# EAGLE design ethercat_shield_mkIIb (EAGLE 9.6.2)
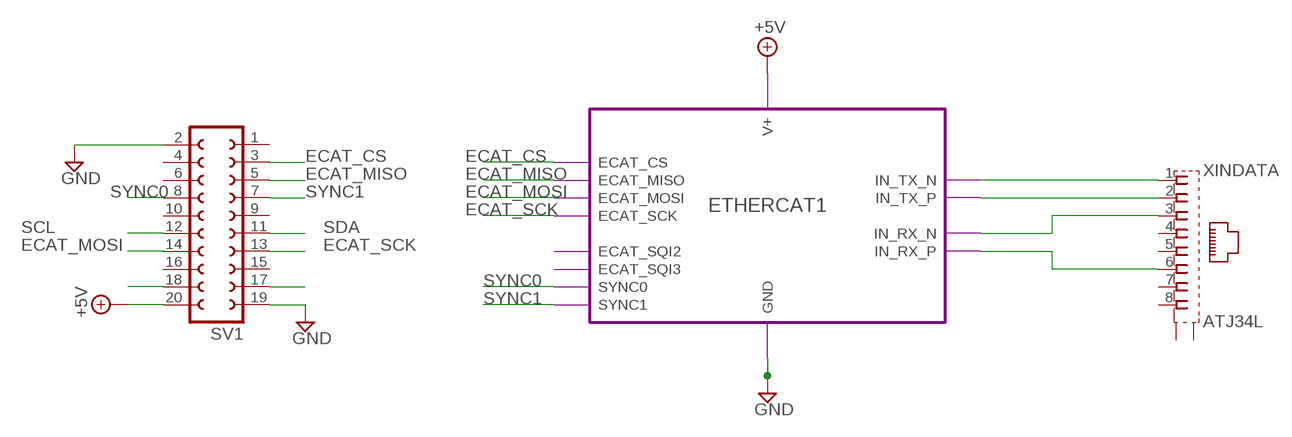
[diagram p0: schematic, sheet 1]

## Parts
SV1  FE10-2W  [FE10-2W]
XIN  ATJ34L  [J1]

## Module instances
ETHERCAT1 = ETHERCAT

## Nets
+5V [power]: SV1.20 ; port ETHERCAT1.V+
ECAT_CS: SV1.3 ; port ETHERCAT1.ECAT_CS
ECAT_MISO: SV1.5 ; port ETHERCAT1.ECAT_MISO
ECAT_MOSI: SV1.14 ; port ETHERCAT1.ECAT_MOSI
ECAT_SCK: SV1.13 ; port ETHERCAT1.ECAT_SCK
GND: SV1.2 SV1.19 ; port ETHERCAT1.GND
N$16: SV1.18
N$19: SV1.17
RA_N: XIN.3 ; port ETHERCAT1.IN_RX_N
RA_P: XIN.6 ; port ETHERCAT1.IN_RX_P
SCL: SV1.12
SDA: SV1.11
SYNC0: SV1.8 ; port ETHERCAT1.SYNC0
SYNC1: SV1.7 ; port ETHERCAT1.SYNC1
TA_N: XIN.1 ; port ETHERCAT1.IN_TX_N
TA_P: XIN.2 ; port ETHERCAT1.IN_TX_P
Unconnected: SV1.1 SV1.4 SV1.6 SV1.9 SV1.10 SV1.15 SV1.16 XIN.4 XIN.5 XIN.7 XIN.8 XIN.9(LY:A) XIN.10(LY:C) XIN.11(LG:A) XIN.12(LG:C) XIN.M1(DATA:S1) XIN.M2(DATA:S2)

## Library data of the parts
SV1 = con-lsta:FE10-2W: FEMALE HEADER; OC_FARNELL: unknown; OC_NEWARK: unknown
XIN = msrm:ATJ34L

## Module ETHERCAT
Ports: ECAT_CS(in) ECAT_MISO(out) ECAT_MOSI(io) ECAT_SCK(in) ECAT_SQI2(io) ECAT_SQI3(io) V+(pwr) GND(pwr) IN_TX_N(out) IN_TX_P(out) IN_RX_N(out) IN_RX_P(out) SYNC0(io) SYNC1(io)
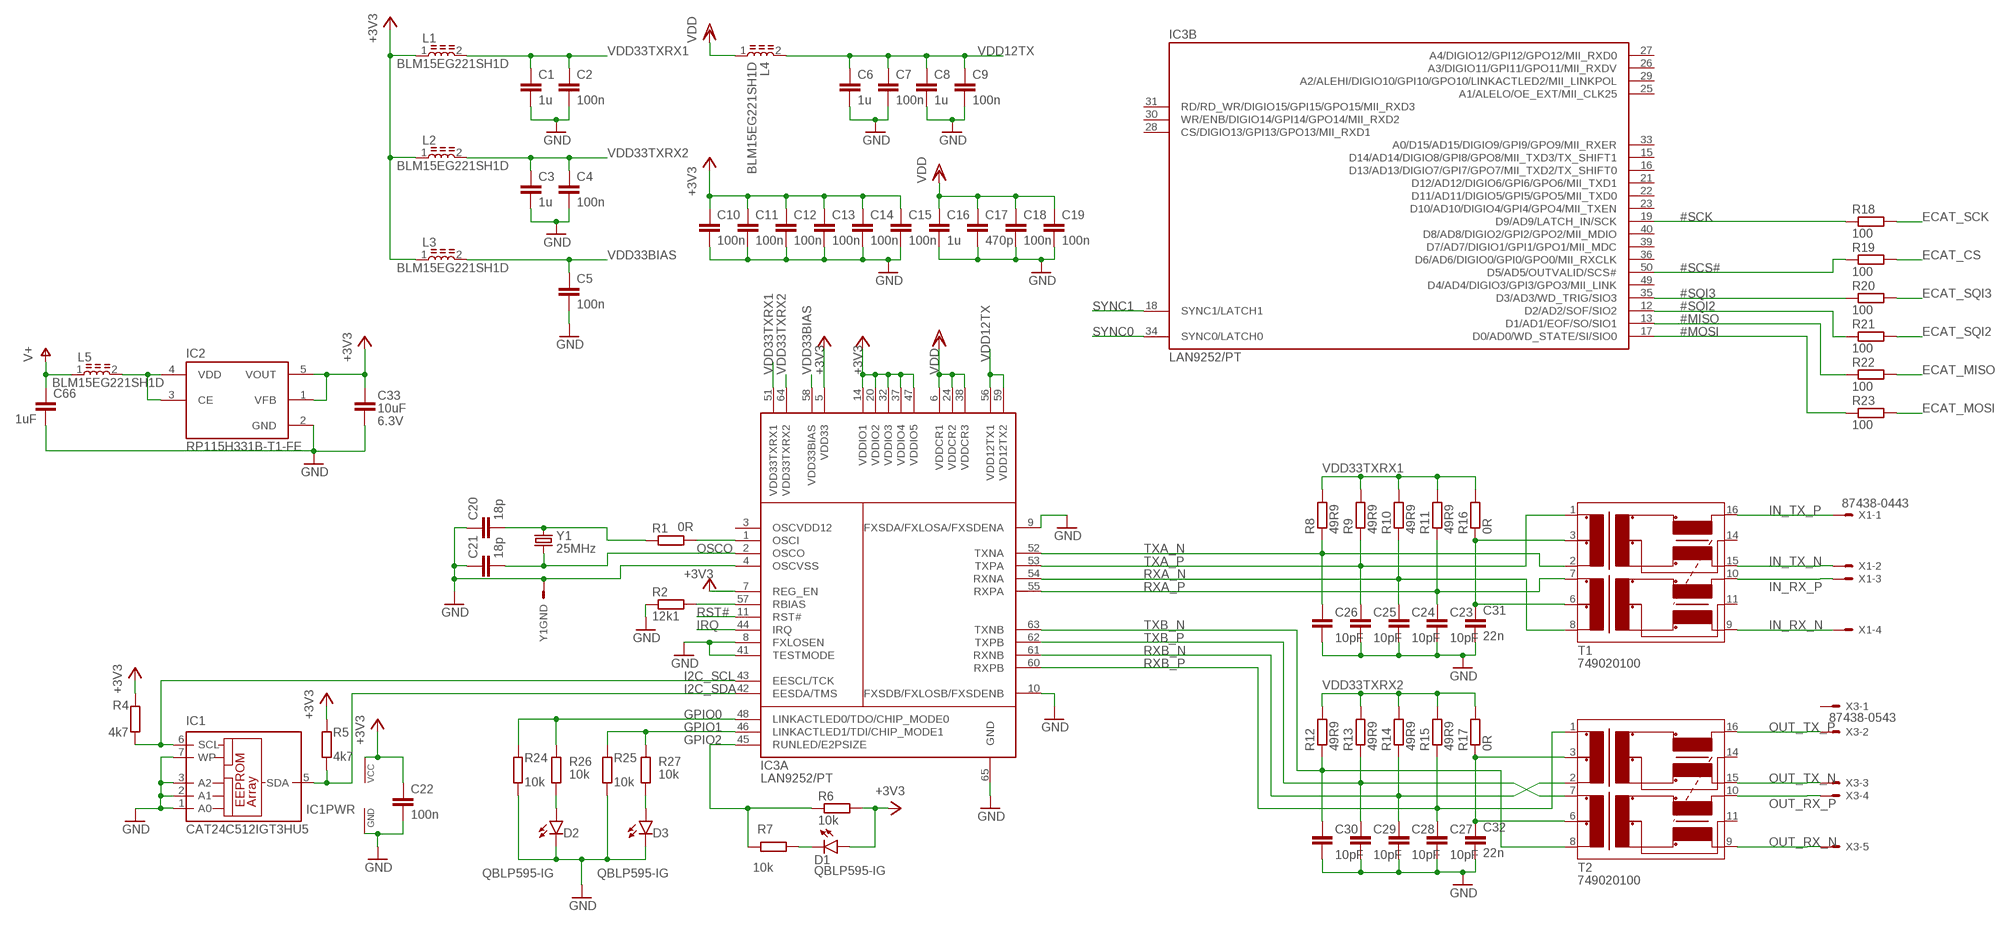
[diagram p1: schematic, module ETHERCAT, sheet 1]

### Parts
C1  1u  GCM155C71A105KE38D  [C0402]
C2  100n  GCM155R71C104JA55  [C0402]
C3  1u  GCM155C71A105KE38D  [C0402]
C4  100n  GCM155R71C104JA55  [C0402]
C5  100n  GCM155R71C104JA55  [C0402]
C6  1u  GCM155C71A105KE38D  [C0402]
C7  100n  GCM155R71C104JA55  [C0402]
C8  1u  GCM155C71A105KE38D  [C0402]
C9  100n  GCM155R71C104JA55  [C0402]
C10  100n  GCM155R71C104JA55  [C0402]
C11  100n  GCM155R71C104JA55  [C0402]
C12  100n  GCM155R71C104JA55  [C0402]
C13  100n  GCM155R71C104JA55  [C0402]
C14  100n  GCM155R71C104JA55  [C0402]
C15  100n  GCM155R71C104JA55  [C0402]
C16  1u  GCM155C71A105KE38D  [C0402]
C17  470p  GCM155R71H471KA37  [C0402]
C18  100n  GCM155R71C104JA55  [C0402]
C19  100n  GCM155R71C104JA55  [C0402]
C20  18p  GCM1555C1H180JA16  [C0402]
C21  18p  GCM1555C1H180JA16  [C0402]
C22  100n  GCM155R71C104JA55  [C0402]
C23  GCM1555C1H100JA16  [C0402]
C24  GCM1555C1H100JA16  [C0402]
C25  GCM1555C1H100JA16  [C0402]
C26  GCM1555C1H100JA16  [C0402]
C27  GCM1555C1H100JA16  [C0402]
C28  GCM1555C1H100JA16  [C0402]
C29  GCM1555C1H100JA16  [C0402]
C30  GCM1555C1H100JA16  [C0402]
C31  22n  GCM155R71E223KA55  [C0402]
C32  22n  GCM155R71E223KA55  [C0402]
C33  GRM155C80J106ME11D  [C0402]
C66  1uF  GCM155C71A105KE38D  [C0402]  (not fitted in variant +3V3)
D1  QBLP595-IG  [LED0402]
D2  QBLP595-IG  [LED0402]
D3  QBLP595-IG  [LED0402]
IC1  CAT24C512IGT3HU5  [UDFN8]
IC2  RP115H331B-T1-FE  [SOT-89-5]
IC3  LAN9252/PT  [TQFP64-T570]
L1  BLM15EG221SH1D  [BEAD0402]
L2  BLM15EG221SH1D  [BEAD0402]
L3  BLM15EG221SH1D  [BEAD0402]
L4  BLM15EG221SH1D  [BEAD0402]
L5  BLM15EG221SH1D  [BEAD0402]
R1  0R  RT0402FRE070RL  [R0402]
R2  12k1  RT0402FRE0712K1L  [R0402]
R4  4k7  RT0402FRE074K7L  [R0402]
R5  4k7  RT0402FRE074K7L  [R0402]
R6  10k  RT0402FRE0710KL  [R0402]
R7  RL0402FR-7W10KL  [R0402]
R8  49R9  RT0402FRE0749R9L  [R0402]
R9  49R9  RT0402FRE0749R9L  [R0402]
R10  49R9  RT0402FRE0749R9L  [R0402]
R11  49R9  RT0402FRE0749R9L  [R0402]
R12  49R9  RT0402FRE0749R9L  [R0402]
R13  49R9  RT0402FRE0749R9L  [R0402]
R14  49R9  RT0402FRE0749R9L  [R0402]
R15  49R9  RT0402FRE0749R9L  [R0402]
R16  0R  RT0402FRE070RL  [R0402]
R17  0R  RT0402FRE070RL  [R0402]
R18  100  RT0402FRE07100RL  [R0402]
R19  100  RT0402FRE07100RL  [R0402]
R20  100  RT0402FRE07100RL  [R0402]
R21  100  RT0402FRE07100RL  [R0402]
R22  100  RT0402FRE07100RL  [R0402]
R23  100  RT0402FRE07100RL  [R0402]
R24  10k  RT0402FRE0710KL  [R0402]
R25  10k  RT0402FRE0710KL  [R0402]
R26  RL0402FR-7W10KL  [R0402]
R27  RL0402FR-7W10KL  [R0402]
T1  749020100  [SOIC127P965X533-16-TRAFO]
T2  749020100  [SOIC127P965X533-16-TRAFO]
X1  87438-0443  [87438-04]
X3  87438-0543  [87438-05]
Y1  ECS-250-18-36B-CKY-TR  [ECX-2236]

### Nets
#MISO: IC3.13(B:D1/AD1/EOF/SO/SIO1) R22.1
#MOSI: IC3.17(B:D0/AD0/WD_STATE/SI/SIO0) R23.1
#SCK: IC3.19(B:D9/AD9/LATCH_IN/SCK) R18.1
#SCS#: IC3.50(B:D5/AD5/OUTVALID/SCS#) R19.1
#SQI2: IC3.12(B:D2/AD2/SOF/SIO2) R21.1
#SQI3: IC3.35(B:D3/AD3/WD_TRIG/SIO3) R20.1
+3V3 [power]: C10.1 C11.1 C12.1 C13.1 C14.1 C15.1 C22.1 C33.1 D1.2(A) IC1.8(VCC) IC2.1(VFB) IC2.5(VOUT) IC3.5(A:VDD33) IC3.7(A:REG_EN) IC3.14(A:VDDIO1) IC3.20(A:VDDIO2) IC3.32(A:VDDIO3) IC3.37(A:VDDIO4) IC3.47(A:VDDIO5) L1.1 L2.1 L3.1 R4.2 R5.2 R6.2
CT1: C31.1 R16.1 T1.3(RCT) T1.6(TCT)
CT2: C32.1 R17.1 T2.3(RCT) T2.6(TCT)
ECAT_CS: R19.2
ECAT_MISO: R22.2
ECAT_MOSI: R23.2
ECAT_SCK: R18.2
ECAT_SQI2: R21.2
ECAT_SQI3: R20.2
GND [power]: C1.2 C2.2 C3.2 C4.2 C5.2 C6.2 C7.2 C8.2 C9.2 C10.2 C11.2 C12.2 C13.2 C14.2 C15.2 C16.2 C17.2 C18.2 C19.2 C20.1 C21.1 C22.2 C23.2 C24.2 C25.2 C26.2 C27.2 C28.2 C29.2 C30.2 C31.2 C32.2 C33.2 C66.2 D2.1(C) D3.1(C) IC1.1(A0) IC1.2(A1) IC1.3(A2) IC1.4(GND) IC1.7(WP) IC1.9(GND) IC2.2(GND) IC3.4(A:OSCVSS) IC3.8(A:FXLOSEN) IC3.9(A:FXSDA/FXLOSA/FXSDENA) IC3.10(A:FXSDB/FXLOSB/FXSDENB) IC3.41(A:TESTMODE) IC3.65(A:GND) R2.1 R24.1 R25.1 Y1.2(S) Y1.4(S)
GPIO0: IC3.48(A:LINKACTLED0/TDO/CHIP_MODE0) R24.2 R26.1
GPIO1: IC3.46(A:LINKACTLED1/TDI/CHIP_MODE1) R25.2 R27.1
GPIO2: IC3.45(A:RUNLED/E2PSIZE) R6.1 R7.2
I2C_SCL: IC1.6(SCL) IC3.43(A:EESCL/TCK) R4.1
I2C_SDA: IC1.5(SDA) IC3.42(A:EESDA/TMS) R5.1
IN_RX_N: T1.9(TX-) X1.4
IN_RX_P: T1.10(TX+) X1.3
IN_TX_N: T1.15(RX-) X1.2
IN_TX_P: T1.16(RX+) X1.1
IRQ: IC3.44(A:IRQ)
N$1: D2.2(A) R26.2
N$2: D3.2(A) R27.2
N$3: IC2.3(CE) IC2.4(VDD) L5.2
N$15: D1.1(C) R7.1
OSCI: IC3.1(A:OSCI) R1.2
OSCI1: C20.2 R1.1 Y1.3
OSCO: C21.2 IC3.2(A:OSCO) Y1.1
OUT_RX_N: T2.9(TX-) X3.5
OUT_RX_P: T2.10(TX+) X3.4
OUT_TX_N: T2.15(RX-) X3.3
OUT_TX_P: T2.16(RX+) X3.2
RBIAS: IC3.57(A:RBIAS) R2.2
RST#: IC3.11(A:RST#)
RXA_N: C24.1 IC3.54(A:RXNA) R10.1 T1.8(TD-)
RXA_P: C23.1 IC3.55(A:RXPA) R11.1 T1.7(TD+)
RXB_N: C28.1 IC3.61(A:RXNB) R14.1 T2.2(RD-)
RXB_P: C27.1 IC3.60(A:RXPB) R15.1 T2.1(RD+)
SYNC0: IC3.34(B:SYNC0/LATCH0)
SYNC1: IC3.18(B:SYNC1/LATCH1)
TXA_N: C26.1 IC3.52(A:TXNA) R8.1 T1.2(RD-)
TXA_P: C25.1 IC3.53(A:TXPA) R9.1 T1.1(RD+)
TXB_N: C30.1 IC3.63(A:TXNB) R12.1 T2.8(TD-)
TXB_P: C29.1 IC3.62(A:TXPB) R13.1 T2.7(TD+)
V+: C66.1 L5.1
VDD [power]: C16.1 C17.1 C18.1 C19.1 IC3.6(A:VDDCR1) IC3.24(A:VDDCR2) IC3.38(A:VDDCR3) L4.1
VDD12TX [power]: C6.1 C7.1 C8.1 C9.1 IC3.56(A:VDD12TX1) IC3.59(A:VDD12TX2) L4.2
VDD33BIAS [power]: C5.1 IC3.58(A:VDD33BIAS) L3.2
VDD33TXRX1 [power]: C1.1 C2.1 IC3.51(A:VDD33TXRX1) L1.2 R8.2 R9.2 R10.2 R11.2 R16.2
VDD33TXRX2 [power]: C3.1 C4.1 IC3.64(A:VDD33TXRX2) L2.2 R12.2 R13.2 R14.2 R15.2 R17.2
Unconnected: IC3.15(B:D14/AD14/DIGIO8/GPI8/GPO8/MII_TXD3/TX_SHIFT1) IC3.16(B:D13/AD13/DIGIO7/GPI7/GPO7/MII_TXD2/TX_SHIFT0) IC3.21(B:D12/AD12/DIGIO6/GPI6/GPO6/MII_TXD1) IC3.22(B:D11/AD11/DIGIO5/GPI5/GPO5/MII_TXD0) IC3.23(B:D10/AD10/DIGIO4/GPI4/GPO4/MII_TXEN) IC3.25(B:A1/ALELO/OE_EXT/MII_CLK25) IC3.26(B:A3/DIGIO11/GPI11/GPO11/MII_RXDV) IC3.27(B:A4/DIGIO12/GPI12/GPO12/MII_RXD0) IC3.28(B:CS/DIGIO13/GPI13/GPO13/MII_RXD1) IC3.29(B:A2/ALEHI/DIGIO10/GPI10/GPO10/LINKACTLED2/MII_LINKPOL) IC3.30(B:WR/ENB/DIGIO14/GPI14/GPO14/MII_RXD2) IC3.31(B:RD/RD_WR/DIGIO15/GPI15/GPO15/MII_RXD3) IC3.33(B:A0/D15/AD15/DIGIO9/GPI9/GPO9/MII_RXER) IC3.36(B:D6/AD6/DIGIO0/GPI0/GPO0/MII_RXCLK) IC3.39(B:D7/AD7/DIGIO1/GPI1/GPO1/MII_MDC) IC3.40(B:D8/AD8/DIGIO2/GPI2/GPO2/MII_MDIO) IC3.49(B:D4/AD4/DIGIO3/GPI3/GPO3/MII_LINK) T1.11(TXCT) T1.14(RXCT) T2.11(TXCT) T2.14(RXCT) X3.1

### Power pins joined to a net without a drawn wire
OSCVDD12: IC3.3(A:OSCVDD12)

### Library data of the parts
C1 C3 C6 C8 C16 C66 = msrm:GCM?C7*: Multilayer Ceramic Capacitors Chip Multilayer Ceramic Capacitors for Automotive Sources: Catalogue <https://www.murata.com/~/media/webrenewal/support/library/catalog/products/capacitor/mlcc/c03e.ashx?la=en-us> Part Numbering <https://search.murata.co.jp/Ceramy/image/img/A01X/partnumbering_e_02.pdf>; CAPACITANCE: 1uF; DIGIKEY: 490-13409-1-ND; TOLERANCE: ±10%; VOLTAGE: 10V
C2 C4 C5 C7 C9-C15 C18 C19 C22 = msrm:GCM?R7*: Multilayer Ceramic Capacitors Chip Multilayer Ceramic Capacitors for Automotive –55 to 125°C Sources: Catalogue <https://www.murata.com/~/media/webrenewal/support/library/catalog/products/capacitor/mlcc/c03e.ashx?la=en-us> Part Numbering <https://search.murata.co.jp/Ceramy/image/img/A01X/partnumbering_e_02.pdf>; CAPACITANCE: 100nF; DIGIKEY: 490-16433-1-ND; TOLERANCE: ±5%; VOLTAGE: 16V
C17 = msrm:GCM?R7*: Multilayer Ceramic Capacitors Chip Multilayer Ceramic Capacitors for Automotive –55 to 125°C Sources: Catalogue <https://www.murata.com/~/media/webrenewal/support/library/catalog/products/capacitor/mlcc/c03e.ashx?la=en-us> Part Numbering <https://search.murata.co.jp/Ceramy/image/img/A01X/partnumbering_e_02.pdf>; CAPACITANCE: 470pF; DIGIKEY: 490-4913-1-ND; TOLERANCE: ±10%; VOLTAGE: 50V
C20 C21 = msrm:GCM?5C*: Multilayer Ceramic Capacitors Chip Multilayer Ceramic Capacitors for Automotive -55°C to 125°C Sources: Catalogue <https://www.murata.com/~/media/webrenewal/support/library/catalog/products/capacitor/mlcc/c03e.ashx?la=en-us> Part Numbering <https://search.murata.co.jp/Ceramy/image/img/A01X/partnumbering_e_02.pdf>; CAPACITANCE: 18pF; DIGIKEY: 490-12650-1-ND; TOLERANCE: ±5%; VOLTAGE: 50V
C23-C30 = msrm:GCM?5C*: Multilayer Ceramic Capacitors Chip Multilayer Ceramic Capacitors for Automotive -55°C to 125°C Sources: Catalogue <https://www.murata.com/~/media/webrenewal/support/library/catalog/products/capacitor/mlcc/c03e.ashx?la=en-us> Part Numbering <https://search.murata.co.jp/Ceramy/image/img/A01X/partnumbering_e_02.pdf>; CAPACITANCE: 10pF; DIGIKEY: 490-10668-1-ND; TOLERANCE: ±5%; VOLTAGE: 50V
C31 C32 = msrm:GCM?R7*: Multilayer Ceramic Capacitors Chip Multilayer Ceramic Capacitors for Automotive –55 to 125°C Sources: Catalogue <https://www.murata.com/~/media/webrenewal/support/library/catalog/products/capacitor/mlcc/c03e.ashx?la=en-us> Part Numbering <https://search.murata.co.jp/Ceramy/image/img/A01X/partnumbering_e_02.pdf>; CAPACITANCE: 22nF; DIGIKEY: 490-6044-1-ND; TOLERANCE: ±10%; VOLTAGE: 25V
C33 = msrm:GRM?C8*; CAPACITANCE: 10uF; DIGIKEY: 490-13233-1-ND; TOLERANCE: ±20%; VOLTAGE: 6.3V
D1-D3 = msrm:QBLP595-: LED; DIGIKEY: 1516-1216-1-ND
IC1 = msrm:CAT24C512: EEPROM Memory IC 512Kb (64K x 8) I²C 1MHz 400ns Source: Datasheet <http://www.onsemi.com/pub/Collateral/CAT24C512-D.PDF>; DIGIKEY: CAT24C512HU5IGT3OSCT-ND; LEAD_FINISH: NiPdAu; TEMPERATURE: -40°C ~ 85°C
IC2 = msrm:RP115H*-T1-FE: The RP115x is a CMOS-based positive voltage regulator featuring 500 mA/ 1.0 A that provides high ripple rejection, low dropout voltage, high output voltage accuracy, and low supply current. Internally, it consists of a voltage reference unit, an error amplifier, a resistor-net for output voltage setting, a current limit circuit, a thermal shutdown circuit, and a reverse current protection circuit. The RP115x uses a CMOS process for achieving low supply current, low On Resistance for low dropout voltage (Typ. 0.195 V (DFN1216-8, IOUT = 1.0 A, VSET = 1.2 V)) and CE function for long battery life. Excellent ripple rejection, input transient response, and load transient response make the RP115x ideal for the power sources of mobile communication equipment. The RP115x is available in the DFN1216-8 package for space saving and the SOT-89-5 (Output Current: 1.0 A fixed) package for higher power applications. The RP115L (DFN1216-8) can choose the output current limit between 1.0 A or 500 mA by alternating the LCON pin between “H” or “L”. The RP115H (SOT-89-5) can output only 1.0 A since it does not include the LCON pin.; VOLTAGE: 3.3V
IC3 = msrm:LAN9252: 2/3-Port EtherCAT® Slave Controller with Integrated Ethernet PHYs package: QFN64-T600 / ML : LAN9252 ___ Source: Digikey <https://www.digikey.de/products/en?keywords=LAN9252/ML-ND> ; Datasheet <http://www.microchip.com/mymicrochip/filehandler.aspx?ddocname=en573610> LAN9252I ___ Source: Digikey <https://www.digikey.de/products/en?keywords=LAN9252I/ML-ND> ; Datasheet <http://www.microchip.com/mymicrochip/filehandler.aspx?ddocname=en573610> LAN9252T___ Source: Digikey <https://www.digikey.de/products/en?keywords=LAN9252T/ML-ND> ; Datasheet <http://www.microchip.com/mymicrochip/filehandler.aspx?ddocname=en573610> LAN9252TI ___ Source: Digikey <https://www.digikey.de/products/en?keywords=LAN9252TI/ML-ND> ; Datasheet <http://www.microchip.com/mymicrochip/filehandler.aspx?ddocname=en573610> LAN9252TV ___ Source: Digikey <https://www.digikey.de/products/en?keywords=LAN9252TV/ML-ND> ; Datasheet <http://www.microchip.com/mymicrochip/filehandler.aspx?ddocname=en573610> LAN9252V ___ Source: Digikey <https://www.digikey.de/products/en?keywords=LAN9252V/ML-ND> ; Datasheet <http://www.microchip.com/mymicrochip/filehandler.aspx?ddocname=en573610> package: TQFP64-T570 / PT : LAN9252 ___ Source: Digikey <https://www.digikey.de/products/en?keywords=LAN9252/PT-ND> ; Datasheet <http://www.microchip.com/mymicrochip/filehandler.aspx?ddocname=en573610> LAN9252I ___ Source: Digikey <https://www.digikey.de/products/en?keywords=LAN9252I/PT-ND> ; Datasheet <http://www.microchip.com/mymicrochip/filehandler.aspx?ddocname=en573610> LAN9252T ___ Source: Digikey <https://www.digikey.de/products/en?keywords=LAN9252T/PT-ND> ; Datasheet <http://www.microchip.com/mymicrochip/filehandler.aspx?ddocname=en573610> LAN9252TI ___ Source: Digikey <https://www.digikey.de/products/en?keywords=LAN9252TI/PT-ND> ; Datasheet <http://www.microchip.com/mymicrochip/filehandler.aspx?ddocname=en573610>; DIGIKEY: LAN9252/PT-ND; TAPE_AND_REEL: Tray; TEMP: 0°C to 70°C
L1-L5 = msrm:BLM?EG*1D: Murata's SMD Ferrite Bead BLM18EG Series Source: Part Numbering <https://www.murata.com/en-us/products/productdata/8796733767710/S0580E.pdf>; DC_RES: 280mOhm; DIGIKEY: 490-17345-1-ND; IMPEDANCE-FREQUENCY: 220 Ohms @ 100MHz
R1 R16 R17 = msrm:RT?FRE07*L: SMD RESISTOR ± 1% Tol, Paper/PE taping reel, 50 ppm/°C, 7 inch dia. Reel Source: Datasheet <http://www.yageo.com/documents/recent/PYu-RT_1-to-0.01_RoHS_L_11.pdf>; DIGIKEY: 311-0.0LRCT-ND; NOTES: Actual Part Number: RC0402FR-070RL; RVALUE: 0R; SPICEPREFIX: R
R2 = msrm:RT?FRE07*L: SMD RESISTOR ± 1% Tol, Paper/PE taping reel, 50 ppm/°C, 7 inch dia. Reel Source: Datasheet <http://www.yageo.com/documents/recent/PYu-RT_1-to-0.01_RoHS_L_11.pdf>; DIGIKEY: RT0402FRE0712K1L-ND; RVALUE: 12k1; SPICEPREFIX: R
R4 R5 = msrm:RT?FRE07*L: SMD RESISTOR ± 1% Tol, Paper/PE taping reel, 50 ppm/°C, 7 inch dia. Reel Source: Datasheet <http://www.yageo.com/documents/recent/PYu-RT_1-to-0.01_RoHS_L_11.pdf>; DIGIKEY: YAG3347CT-ND; RVALUE: 4k7; SPICEPREFIX: R
R6 R24 R25 = msrm:RT?FRE07*L: SMD RESISTOR ± 1% Tol, Paper/PE taping reel, 50 ppm/°C, 7 inch dia. Reel Source: Datasheet <http://www.yageo.com/documents/recent/PYu-RT_1-to-0.01_RoHS_L_11.pdf>; DIGIKEY: YAG1233CT-ND; RVALUE: 10k; SPICEPREFIX: R
R7 R26 R27 = msrm:RL?FR-7W*L: SMD RESISTOR ± 1% Tol, Paper/PE taping reel, 50 ppm/°C, 7 inch dia. Reel Source: Datasheet <http://www.yageo.com/documents/recent/PYu-RT_1-to-0.01_RoHS_L_11.pdf>; RVALUE: 10k; SPICEPREFIX: R
R8-R15 = msrm:RT?FRE07*L: SMD RESISTOR ± 1% Tol, Paper/PE taping reel, 50 ppm/°C, 7 inch dia. Reel Source: Datasheet <http://www.yageo.com/documents/recent/PYu-RT_1-to-0.01_RoHS_L_11.pdf>; DIGIKEY: YAG3346CT-ND; RVALUE: 49R9; SPICEPREFIX: R
R18-R23 = msrm:RT?FRE07*L: SMD RESISTOR ± 1% Tol, Paper/PE taping reel, 50 ppm/°C, 7 inch dia. Reel Source: Datasheet <http://www.yageo.com/documents/recent/PYu-RT_1-to-0.01_RoHS_L_11.pdf>; DIGIKEY: YAG3342CT-ND; RVALUE: 100; SPICEPREFIX: R
T1 T2 = msrm:749020100: 350µH LAN 10/100 Base-T, Power over Ethernet (PoE) Pulse Transformer 1:1 Surface Mount; DIGIKEY: 732-3268-1-ND
X1 = msrm:8743?-04*3: Wire-to-Board 1.50mm (.059") Pitch Header - SMT, Shrouded Source: http://www.molex.com/product/micro/87437.html; DIGIKEY: WM7648CT-ND; MF: MOLEX
X3 = msrm:8743?-05*3: Wire-to-Board 1.50mm (.059") Pitch Header -SMT, Shrouded Source: http://www.molex.com/product/micro/87438.html; COLOR: beige; DIGIKEY: WM7649CT-ND
Y1 = msrm:ECS-*?-TR: SMD CRYSTAL Various frequencies, with GND pins Part Numbering <http://www.ecsxtal.com/store/pdf/partnumber4.pdf>; DIGIKEY: XC3051CT-ND; F: 25MHz; F_TOLERANCE: ±10ppm; L_CAPACITANCE: 18pF

## Net classes
0 default: width 0.152 mm, drill 0.2 mm, clearance 0.076 mm
1 power: width 0.229 mm, drill 0.2 mm, clearance 0.152 mm
3 power3V3: width 0.254 mm, drill 0.2 mm, clearance 0.152 mm

## Board
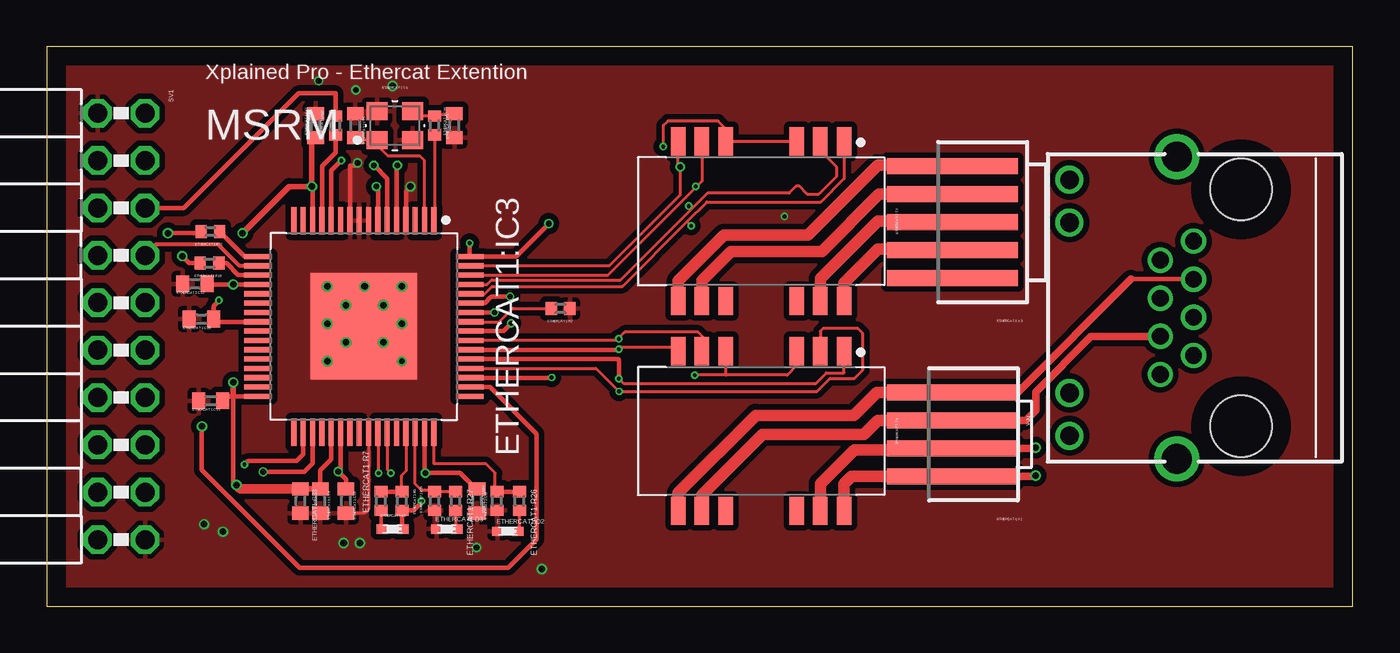
[diagram p2: board, top side]
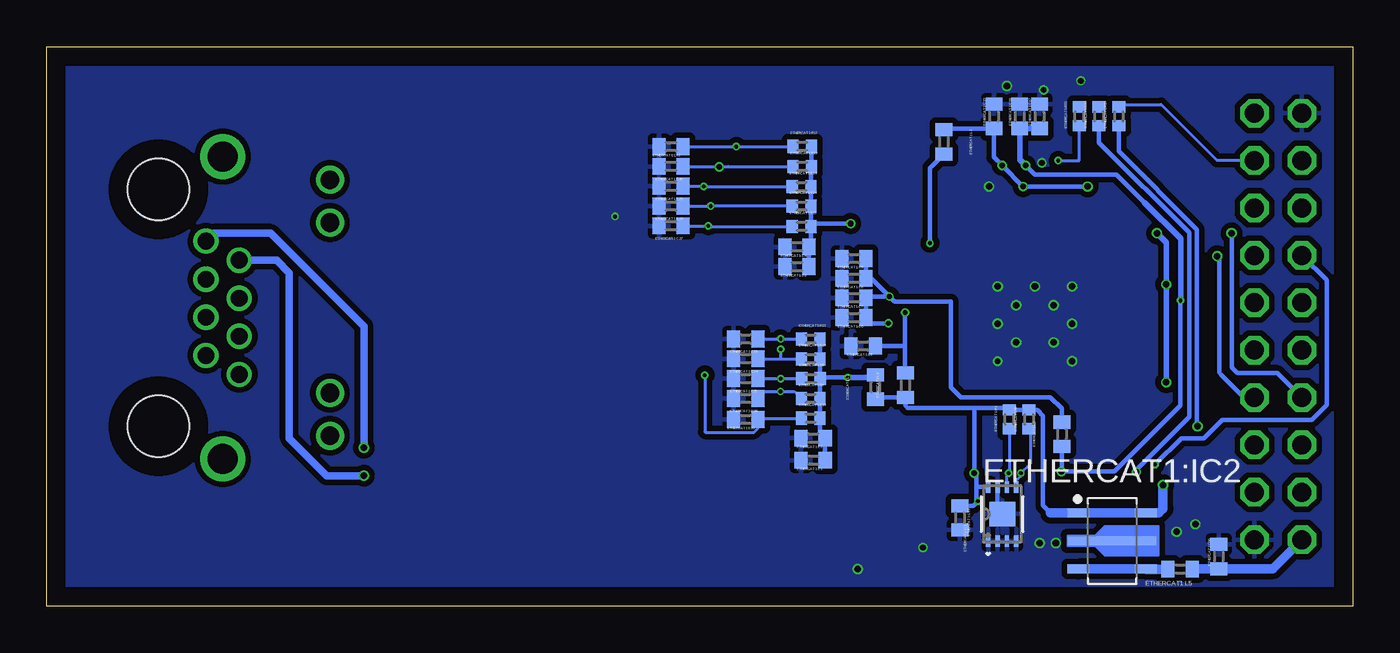
[diagram p3: board, bottom side, seen from below]

Size 70 x 30 mm. Coordinates in mm from the lower left corner, seen from the top.
Outline: 0,0 70,0 70,30 0,30 0,0
Copper layers (1*16): Top 0.035mm / dielectric 1.5mm / Bottom 0.035mm
Design rules "default *": minimum track width 0.1mm, minimum drill 0.2mm, track to track 0.1mm, track to pad 0.1mm, pad to pad 0.1mm, via to via 0.1mm, smd to smd 0.1mm, copper to edge 40mil, drill to drill 6mil, minimum pad ring 0.1mm, minimum via ring 0.1mm, stop-mask expansion 4mil, vias tented up to drill 0mil, thermal gap 10mil

### Footprints (pad centres in the part's own frame; a part is rotated, then mirrored left to right if it is on the bottom)
C0402 = smd 0.7 x 0.9: 1 -0.65,0; 2 0.65,0
LED0402 = smd 0.6 x 0.5: 1 -0.55,0; 2 0.55,0
UDFN8 = smd 0.606 x 0.225: 1 -1.446,0.75; 2 -1.446,0.25; 3 -1.446,-0.25; 4 -1.446,-0.75; 5 1.446,-0.75; 6 1.446,-0.25; 7 1.446,0.25; 8 1.446,0.75 | smd 1.295 x 1.397: 9 0,0
SOT-89-5 = smd 1.17 x 0.491: 1 -1.814,1.5; 3 -1.814,-1.5; 4 1.814,-1.5; 5 1.814,1.5 | smd 4.75 x 0.491: 2 0,0
TQFP64-T570 = smd 1.469 x 0.28: 1 -5.671,3.75; 2 -5.671,3.25; 3 -5.671,2.75; 4 -5.671,2.25; 5 -5.671,1.75; 6 -5.671,1.25; 7 -5.671,0.75; 8 -5.671,0.25; 9 -5.671,-0.25; 10 -5.671,-0.75; 11 -5.671,-1.25; 12 -5.671,-1.75; 13 -5.671,-2.25; 14 -5.671,-2.75; 15 -5.671,-3.25; 16 -5.671,-3.75; 33 5.671,-3.75; 34 5.671,-3.25; 35 5.671,-2.75; 36 5.671,-2.25; 37 5.671,-1.75; 38 5.671,-1.25; 39 5.671,-0.75; 40 5.671,-0.25; 41 5.671,0.25; 42 5.671,0.75; 43 5.671,1.25; 44 5.671,1.75; 45 5.671,2.25; 46 5.671,2.75; 47 5.671,3.25; 48 5.671,3.75 | smd 0.28 x 1.469: 17 -3.75,-5.671; 18 -3.25,-5.671; 19 -2.75,-5.671; 20 -2.25,-5.671; 21 -1.75,-5.671; 22 -1.25,-5.671; 23 -0.75,-5.671; 24 -0.25,-5.671; 25 0.25,-5.671; 26 0.75,-5.671; 27 1.25,-5.671; 28 1.75,-5.671; 29 2.25,-5.671; 30 2.75,-5.671; 31 3.25,-5.671; 32 3.75,-5.671; 49 3.75,5.671; 50 3.25,5.671; 51 2.75,5.671; 52 2.25,5.671; 53 1.75,5.671; 54 1.25,5.671; 55 0.75,5.671; 56 0.25,5.671; 57 -0.25,5.671; 58 -0.75,5.671; 59 -1.25,5.671; 60 -1.75,5.671; 61 -2.25,5.671; 62 -2.75,5.671; 63 -3.25,5.671; 64 -3.75,5.671 | smd 5.7 x 5.7: 65 0,0
BEAD0402 = smd 0.7 x 0.9: 1 -0.65,0; 2 0.65,0
R0402 = smd 0.6 x 0.7: 1 -0.5,0; 2 0.5,0
SOIC127P965X533-16-TRAFO = smd 1.512 x 0.772: 1 -4.275,4.445; 2 -4.275,3.175; 3 -4.275,1.905; 6 -4.275,-1.905; 7 -4.275,-3.175; 8 -4.275,-4.445; 9 4.275,-4.445; 10 4.275,-3.175; 11 4.275,-1.905; 14 4.275,1.905; 15 4.275,3.175; 16 4.275,4.445
87438-04 = smd 7 x 0.85: 1 0,2.25; 2 0,0.75; 3 0,-0.75; 4 0,-2.25
87438-05 = smd 7 x 0.85: 1 0,3; 2 0,1.5; 3 0,0; 4 0,-1.5; 5 0,-3
ECX-2236 = smd 1.112 x 0.962: 1 -0.95,-0.775; 2 0.95,-0.775; 3 0.95,0.775; 4 -0.95,0.775
FE10-2W = drill 1.016 octagon: 1 -11.43,1.27; 2 -11.43,-1.27; 3 -8.89,1.27; 4 -8.89,-1.27; 5 -6.35,1.27; 6 -6.35,-1.27; 7 -3.81,1.27; 8 -3.81,-1.27; 9 -1.27,1.27; 10 -1.27,-1.27; 11 1.27,1.27; 12 1.27,-1.27; 13 3.81,1.27; 14 3.81,-1.27; 15 6.35,1.27; 16 6.35,-1.27; 17 8.89,1.27; 18 8.89,-1.27; 19 11.43,1.27; 20 11.43,-1.27
J1 = drill 0.9 pad 1.3: 1 3.57,2.54; 2 2.55,4.32; 3 1.53,2.54; 4 0.51,4.32; 5 -0.51,2.54; 6 -1.53,4.32; 7 -2.55,2.54; 8 -3.57,4.32 | drill 1 pad 1.422: 9 -6.86,9.18; 10 -4.57,9.18; 11 4.57,9.18; 12 6.86,9.18 | drill 1.6 pad 2.184: M1 8.1,3.43; M2 -8.1,3.43 | hole 3.3: -6.35,0; 6.35,0

### Placement (x,y rotation side)
ETHERCAT1:C1  1u  [C0402]  28.93,7.83 180 bottom
ETHERCAT1:C2  100n  [C0402]  28.93,9.01 180 bottom
ETHERCAT1:C3  1u  [C0402]  29.79,18.2 180 bottom
ETHERCAT1:C4  100n  [C0402]  29.79,19.27 180 bottom
ETHERCAT1:C5  100n  [C0402]  26.24,13.95 180 bottom
ETHERCAT1:C6  1u  [C0402]  26.74,15.47 180 bottom
ETHERCAT1:C7  100n  [C0402]  26.74,16.53 180 bottom
ETHERCAT1:C8  1u  [C0402]  26.74,17.58 180 bottom
ETHERCAT1:C9  100n  [C0402]  26.74,18.64 180 bottom
ETHERCAT1:C10  100n  [C0402]  19.23,26.27 90 bottom
ETHERCAT1:C11  100n  [C0402]  14.41,25.77 90 top
ETHERCAT1:C12  100n  [C0402]  7.95,17.28 180 top
ETHERCAT1:C13  100n  [C0402]  8.79,11.02 180 top
ETHERCAT1:C14  100n  [C0402]  14.66,5.64 270 top
ETHERCAT1:C15  100n  [C0402]  23.07,5.64 270 top
ETHERCAT1:C16  1u  [C0402]  17.85,26.27 90 bottom
ETHERCAT1:C17  470p  [C0402]  16.79,26.27 90 bottom
ETHERCAT1:C18  100n  [C0402]  8.29,15.39 180 top
ETHERCAT1:C19  100n  [C0402]  16.04,5.64 270 top
ETHERCAT1:C20  18p  [C0402]  21.85,25.77 90 top
ETHERCAT1:C21  18p  [C0402]  16.54,25.77 270 top
ETHERCAT1:C22  100n  [C0402]  21.05,4.74 270 bottom
ETHERCAT1:C23  GCM1555C1H100JA16  [C0402]  32.54,14.33 180 bottom
ETHERCAT1:C24  GCM1555C1H100JA16  [C0402]  32.54,13.27 180 bottom
ETHERCAT1:C25  GCM1555C1H100JA16  [C0402]  32.54,12.2 180 bottom
ETHERCAT1:C26  GCM1555C1H100JA16  [C0402]  32.54,11.14 180 bottom
ETHERCAT1:C27  GCM1555C1H100JA16  [C0402]  36.54,20.39 180 bottom
ETHERCAT1:C28  GCM1555C1H100JA16  [C0402]  36.54,21.45 180 bottom
ETHERCAT1:C29  GCM1555C1H100JA16  [C0402]  36.54,22.52 180 bottom
ETHERCAT1:C30  GCM1555C1H100JA16  [C0402]  36.54,23.58 180 bottom
ETHERCAT1:C31  22n  [C0402]  32.54,10.02 180 bottom
ETHERCAT1:C32  22n  [C0402]  36.54,24.64 180 bottom
ETHERCAT1:C33  GRM155C80J106ME11D  [C0402]  13.6,5.64 270 top
ETHERCAT1:C66  1uF  [C0402]  7.18,2.66 90 bottom
ETHERCAT1:D1  QBLP595-IG  [LED0402]  18.54,4.14 0 top
ETHERCAT1:D2  QBLP595-IG  [LED0402]  24.71,4.01 0 top
ETHERCAT1:D3  QBLP595-IG  [LED0402]  21.44,4.14 0 top
ETHERCAT1:IC1  CAT24C512IGT3HU5  [UDFN8]  18.79,4.94 90 bottom
ETHERCAT1:IC2  RP115H331B-T1-FE  [SOT-89-5]  12.9,3.5 0 bottom
ETHERCAT1:IC3  LAN9252/PT  [TQFP64-T570]  17,15 270 top
ETHERCAT1:L1  BLM15EG221SH1D  [BEAD0402]  25.59,11.75 90 bottom
ETHERCAT1:L2  BLM15EG221SH1D  [BEAD0402]  21.91,24.89 270 bottom
ETHERCAT1:L3  BLM15EG221SH1D  [BEAD0402]  23.98,11.85 90 bottom
ETHERCAT1:L4  BLM15EG221SH1D  [BEAD0402]  15.59,9.21 90 bottom
ETHERCAT1:L5  BLM15EG221SH1D  [BEAD0402]  9.26,1.99 180 bottom
ETHERCAT1:R1  0R  [R0402]  20.79,25.77 270 top
ETHERCAT1:R2  12k1  [R0402]  27.54,15.96 180 top
ETHERCAT1:R4  4k7  [R0402]  18.41,10.02 90 bottom
ETHERCAT1:R5  4k7  [R0402]  17.35,10.02 90 bottom
ETHERCAT1:R6  10k  [R0402]  19.04,5.64 270 top
ETHERCAT1:R7  RL0402FR-7W10KL  [R0402]  17.91,5.64 90 top
ETHERCAT1:R8  49R9  [R0402]  29.05,11.14 0 bottom
ETHERCAT1:R9  49R9  [R0402]  29.04,12.2 0 bottom
ETHERCAT1:R10  49R9  [R0402]  29.05,13.27 0 bottom
ETHERCAT1:R11  49R9  [R0402]  29.05,14.33 0 bottom
ETHERCAT1:R12  49R9  [R0402]  29.51,23.57 0 bottom
ETHERCAT1:R13  49R9  [R0402]  29.54,22.49 0 bottom
ETHERCAT1:R14  49R9  [R0402]  29.54,21.45 0 bottom
ETHERCAT1:R15  49R9  [R0402]  29.54,20.36 0 bottom
ETHERCAT1:R16  0R  [R0402]  29.05,10.08 0 bottom
ETHERCAT1:R17  0R  [R0402]  29.51,24.65 0 bottom
ETHERCAT1:R18  100  [R0402]  8.73,18.39 180 top
ETHERCAT1:R19  100  [R0402]  12.54,26.27 90 bottom
ETHERCAT1:R20  100  [R0402]  13.6,26.27 90 bottom
ETHERCAT1:R21  100  [R0402]  14.66,26.27 90 bottom
ETHERCAT1:R22  100  [R0402]  15.48,25.77 90 top
ETHERCAT1:R23  100  [R0402]  8.78,20.08 180 top
ETHERCAT1:R24  10k  [R0402]  24.13,5.64 90 top
ETHERCAT1:R25  10k  [R0402]  20.79,5.64 90 top
ETHERCAT1:R26  RL0402FR-7W10KL  [R0402]  25.34,5.64 270 top
ETHERCAT1:R27  RL0402FR-7W10KL  [R0402]  21.91,5.64 270 top
ETHERCAT1:T1  749020100  [SOIC127P965X533-16-TRAFO]  38.29,9.39 270 top
ETHERCAT1:T2  749020100  [SOIC127P965X533-16-TRAFO]  38.29,20.64 270 top
ETHERCAT1:X1  87438-0443  [87438-04]  48.54,9.21 180 top
ETHERCAT1:X3  87438-0543  [87438-05]  48.54,20.59 180 top
ETHERCAT1:Y1  [ECX-2236]  18.66,25.77 0 top
SV1  4,15 270 top
XIN  64,16 90 top

### Tracks (layer width: path | path; a pad name or v marks a point on that pad's centre or on a via)
+5V
  Bottom 0.508: SV1.20 4.29,2.01 ETHERCAT1:C66.1 8.59,2.01 ETHERCAT1:L5.1
ECAT_CS
  Bottom 0.152: SV1.3 7.27,23.89 10.27,26.89 12.41,26.89 ETHERCAT1:R19.2
ECAT_MISO
  Top 0.254: ETHERCAT1:R22.2 15.48,27.5 13.5,27.5 7.35,21.35 SV1.5
ECAT_MOSI  (via drill 0.35)
  Top 0.229: ETHERCAT1:R23.2 8.2,20 v6.5,20
  Bottom 0.254: SV1.14 4.04,12.5 6.2,12.5 6.5,12.8 v6.5,20
ECAT_SCK  (via drill 0.35)
  Top 0.229: ETHERCAT1:R18.2 7.64,18.39 v7.27,18.77
  Bottom 0.229: 7.07,12.43 7.16,12.52 7.16,18.72 7.24,18.8 v7.27,18.77
  Bottom 0.254: SV1.13 5.83,11.19 7.07,12.43
ETHERCAT1:#MISO
  Top 0.229: ETHERCAT1:R22.1 15.48,24.33 14.75,23.6 ETHERCAT1:IC3.13
ETHERCAT1:#MOSI
  Top 0.229: ETHERCAT1:R23.1 10.61,18.75 ETHERCAT1:IC3.17
ETHERCAT1:#SCK
  Top 0.229: ETHERCAT1:IC3.19 10.28,17.75 9.63,18.39 ETHERCAT1:R18.1
ETHERCAT1:#SCS#  (via drill 0.35)
  Top 0.229: v8.32,9.64 8.32,7.29 13.55,2.06 24.73,2.06 26.26,3.59 26.26,9.24 23.75,11.75 ETHERCAT1:IC3.50
  Bottom 0.229: ETHERCAT1:R19.1 12.54,24.39 8.35,20.2 8.35,9.68 v8.32,9.64
ETHERCAT1:#SQI2  (via drill 0.2)
  Top 0.229: v15.79,23.89 15.25,23.35 ETHERCAT1:IC3.12
  Bottom 0.152: v15.79,23.89 14.66,23.89 ETHERCAT1:R21.1
ETHERCAT1:#SQI3  (via drill 0.3)
  Top 0.229: ETHERCAT1:IC3.35 14.25,7.65 13.8,7.2 v11.6,7.2
  Bottom 0.229: ETHERCAT1:R20.1 13.6,24.86 8.77,20.02 8.77,10.15 11.6,7.32 v11.6,7.2
ETHERCAT1:+3V3  (via drill 0.2, 0.3, 0.35)
  Top 0.229: ETHERCAT1:C15.1 23.01,6.29 22.16,7.14 v20.29,7.14 20.25,7.18 ETHERCAT1:IC3.47 | ETHERCAT1:D1.2 19.04,4.21 ETHERCAT1:R6.2 19.66,5.14 20.09,5.56 v20.09,5.64 | ETHERCAT1:C14.1 14.66,7.29 15.25,7.88 ETHERCAT1:IC3.37 | ETHERCAT1:IC3.20 v10,17.25 8.63,17.25 ETHERCAT1:C12.1 | ETHERCAT1:IC3.32 10.2,11.25 10,11.25 | ETHERCAT1:IC3.7 17.75,22.42 v17.67,22.5 | ETHERCAT1:IC3.14 14.25,22.46 v14.21,22.5 | ETHERCAT1:IC3.5 18.75,23.6 v18.79,23.64
  Top 0.254: ETHERCAT1:C13.1 9.68,11.25 10,11.25 10,6.67 10.38,6.29 | 14.21,24.91 ETHERCAT1:C11.1
  Top 0.305: ETHERCAT1:C14.1 ETHERCAT1:C33.1 | v10,12 10,11.25 | 14.21,24.91 v14.21,22.5 13,22.5 v10.5,20
  Top 0.508: ETHERCAT1:C33.1 10.38,6.29 v10.17,6.5
  Bottom 0.229: 20.29,10.64 v20.29,7.14 20.16,7.01 20.16,6.39 | 20.29,10.64 18.41,10.64 ETHERCAT1:R4.2 ETHERCAT1:R5.2 16.91,10.52 16.6,10.2 16.6,5.4 16.2,5 | 20.16,6.39 20.16,5.64 v20.09,5.64 20.34,5.38 ETHERCAT1:C22.1 | ETHERCAT1:IC1.8 20.16,6.39 | ETHERCAT1:L2.1 21.84,25.61 ETHERCAT1:C10.1 19.23,24.08 v18.79,23.64 18.79,23.62 v17.67,22.5 v14.21,22.5 | 20.29,10.64 23.86,10.64 23.98,10.75 ETHERCAT1:L3.1 25.49,11.2 ETHERCAT1:L1.1
  Bottom 0.305: v10.5,20 10,19.5 v10,17.25 v10,12
  Bottom 0.508: 13,5 ETHERCAT1:IC2.1 13,5 | 16.2,5 13,5 | 13,5 ETHERCAT1:IC2.5 | 13,5 10.4,5 10.17,5.23 v10.17,6.5
ETHERCAT1:CT1  (via drill 0.2)
  Top 0.152: ETHERCAT1:T1.3 40.2,12.89 39.69,12.39 36.41,12.39 | 36.41,12.39 v34.73,12.39 | ETHERCAT1:T1.6 36.38,12.42 36.41,12.39
  Bottom 0.152: v34.73,12.39 34.73,9.36 34.7,9.33 32.1,9.33 31.89,9.54 ETHERCAT1:C31.1 31.83,10.08 ETHERCAT1:R16.1
ETHERCAT1:CT2  (via drill 0.2)
  Top 0.152: ETHERCAT1:T2.3 ETHERCAT1:T2.6 36.38,25.61 35.98,26.02 33.29,26.02 33.04,25.77 v33.04,24.64
  Bottom 0.152: ETHERCAT1:C32.1 v33.04,24.64 v33.03,24.65 ETHERCAT1:R17.1
ETHERCAT1:GPIO0
  Top 0.152: ETHERCAT1:R24.2 24.04,6.23 24.04,7.14 23.54,7.64 20.75,7.64 ETHERCAT1:IC3.48
  Top 0.229: ETHERCAT1:R24.2 ETHERCAT1:R26.1
ETHERCAT1:GPIO1
  Top 0.152: ETHERCAT1:R27.1 ETHERCAT1:R25.2 20.73,6.2 20.1,6.2 19.75,6.55 ETHERCAT1:IC3.46
ETHERCAT1:GPIO2
  Top 0.152: ETHERCAT1:IC3.45 19.25,7.25 19,7 19,6.18 ETHERCAT1:R6.1
  Top 0.229: ETHERCAT1:R7.2 ETHERCAT1:R6.1
ETHERCAT1:I2C_SCL  (via drill 0.2)
  Top 0.152: ETHERCAT1:IC3.43 18.25,7.33 v18.44,7.14
  Bottom 0.152: ETHERCAT1:R4.1 18.41,7.17 v18.44,7.14 18.54,7.04 ETHERCAT1:IC1.6
ETHERCAT1:I2C_SDA  (via drill 0.2)
  Top 0.152: ETHERCAT1:IC3.42 17.75,7.18 v17.79,7.14
  Bottom 0.152: ETHERCAT1:R5.1 17.29,9.58 17.29,7.64 v17.79,7.14 17.79,6.99 18.04,6.74 ETHERCAT1:IC1.5
ETHERCAT1:N$1
  Top 0.152: ETHERCAT1:D2.2 25.34,4.09 ETHERCAT1:R26.2
ETHERCAT1:N$2
  Top 0.152: ETHERCAT1:D3.2 21.94,4.19 21.91,4.19 ETHERCAT1:R27.2
ETHERCAT1:N$3
  Bottom 0.508: ETHERCAT1:L5.2 11.08,1.99 ETHERCAT1:IC2.4 ETHERCAT1:IC2.3
ETHERCAT1:N$15
  Top 0.2: ETHERCAT1:R7.1 17.91,4.19 ETHERCAT1:D1.1
ETHERCAT1:OSCI
  Top 0.152: ETHERCAT1:R1.2 20.79,20.71 ETHERCAT1:IC3.1
ETHERCAT1:OSCI1
  Top 0.152: ETHERCAT1:C20.2 20.89,26.36 ETHERCAT1:R1.1 19.89,26.27 ETHERCAT1:Y1.3
ETHERCAT1:OSCO
  Top 0.152: ETHERCAT1:C21.2 16.71,24.99 ETHERCAT1:Y1.1 17.71,24.71 18.29,24.14 20,24.14 20.25,23.89 ETHERCAT1:IC3.2
ETHERCAT1:OUT_RX_N
  Top 0.61: ETHERCAT1:T2.9 33.84,17.45 36.29,19.89 40.79,19.89 44.54,23.64 48.49,23.64 ETHERCAT1:X3.5
ETHERCAT1:OUT_RX_P
  Top 0.61: ETHERCAT1:T2.10 35.12,17.46 36.66,19.02 41.54,19.02 44.62,22.09 ETHERCAT1:X3.4
ETHERCAT1:OUT_TX_N
  Top 0.61: ETHERCAT1:T2.15 41.47,17.57 44.54,20.64 48.49,20.64 ETHERCAT1:X3.3
ETHERCAT1:OUT_TX_P
  Top 0.61: ETHERCAT1:T2.16 42.73,17.34 44.54,19.14 48.49,19.14 ETHERCAT1:X3.2
ETHERCAT1:RBIAS
  Top 0.152: ETHERCAT1:R2.2 24.98,15.96 24.26,15.24 24.25,15.25 ETHERCAT1:IC3.57
ETHERCAT1:RXA_N  (via drill 0.2)
  Top 0.152: v30.66,13.78 30.66,13.89 33.62,13.89 ETHERCAT1:T1.8
  Top 0.229: ETHERCAT1:IC3.54 30.64,13.75 v30.66,13.78
  Bottom 0.152: ETHERCAT1:C24.1 30.66,13.27 | 30.66,13.27 ETHERCAT1:R10.1 | v30.66,13.78 30.66,13.27
ETHERCAT1:RXA_P  (via drill 0.2)
  Top 0.152: ETHERCAT1:T1.7 35.12,13.97 35.22,13.87 35.22,14.39 34.92,14.7 30.97,14.7 30.66,14.39 v30.66,14.33 30.66,14.25 ETHERCAT1:IC3.55
  Bottom 0.152: ETHERCAT1:C23.1 v30.66,14.33 ETHERCAT1:R11.1
ETHERCAT1:RXB_N  (via drill 0.2)
  Top 0.152: 34.57,21.3 35.41,22.14 39.79,22.14 40.16,22.52 40.35,22.52 40.76,22.11 41.38,22.11 42.34,23.07 42.34,23.54 41.47,24.41 ETHERCAT1:T2.2 | 34.57,21.3 v34.41,21.45 | 34.57,21.3 30.77,17.49 30.76,17.5 23.85,17.5 23.6,17.25 ETHERCAT1:IC3.61
  Bottom 0.152: ETHERCAT1:C28.1 v34.41,21.45 ETHERCAT1:R14.1
ETHERCAT1:RXB_P  (via drill 0.2)
  Top 0.152: 34.32,20.61 30.86,17.15 23.88,17.15 23.48,16.75 ETHERCAT1:IC3.60 | 34.32,20.61 35.38,21.68 41.49,21.68 42.73,22.92 ETHERCAT1:T2.1 | 34.32,20.61 v34.54,20.39
  Bottom 0.152: ETHERCAT1:C27.1 v34.54,20.39 34.51,20.36 ETHERCAT1:R15.1
ETHERCAT1:TXA_N  (via drill 0.2)
  Top 0.152: 43.72,14.64 | ETHERCAT1:T1.2 41.47,14.75 41.59,14.88 43.48,14.88 43.72,14.64 | ETHERCAT1:IC3.52 29.44,12.75 v30.68,11.51 v30.68,11.52 41.29,11.52 41.98,12.21 43.29,12.21 43.72,12.64 43.72,14.64
  Bottom 0.152: ETHERCAT1:C26.1 31.52,11.51 v30.68,11.51 29.93,11.51 ETHERCAT1:R8.1
ETHERCAT1:TXA_P  (via drill 0.2)
  Top 0.152: v30.67,12.2 30.95,11.92 41.19,11.92 41.79,12.52 42.72,12.52 42.73,12.53 ETHERCAT1:T1.1
  Top 0.229: ETHERCAT1:IC3.53 30.62,13.25 30.67,13.2 v30.67,12.2
  Bottom 0.152: ETHERCAT1:R9.1 v30.67,12.2 ETHERCAT1:C25.1
ETHERCAT1:TXB_N  (via drill 0.3)
  Top 0.152: ETHERCAT1:IC3.63 30.15,18.25 33.95,22.05 v33.95,23.55 33.84,23.45 ETHERCAT1:T2.8
  Bottom 0.152: ETHERCAT1:C30.1 33.48,23.58 33.47,23.57 | 33.47,23.57 33.97,23.57 v33.95,23.55 | 33.47,23.57 ETHERCAT1:R12.1
ETHERCAT1:TXB_P  (via drill 0.2)
  Top 0.152: ETHERCAT1:T2.7 35.12,22.78 34.85,22.52 v34.79,22.52 34.79,22.46 30.08,17.75 ETHERCAT1:IC3.62
  Bottom 0.152: ETHERCAT1:C29.1 v34.79,22.52 34.76,22.49 ETHERCAT1:R13.1
ETHERCAT1:VDD  (via drill 0.2, 0.3)
  Top 0.229: v9.23,16.39 8.94,16.1 ETHERCAT1:C18.1 9.08,15.25 ETHERCAT1:IC3.24 | ETHERCAT1:C19.1 16.04,6.8 v15.62,7.22 15.75,7.35 ETHERCAT1:IC3.38 | ETHERCAT1:IC3.6 18.25,22.93 v17.54,23.64
  Bottom 0.229: v9.23,16.39 9.23,10.77 12.78,7.22 v15.62,7.22 15.59,7.25 ETHERCAT1:L4.1 | v17.54,23.64 17.04,23.14 12.66,23.14 11.16,21.64
  Bottom 0.305: v17.54,23.64 17.85,23.95 ETHERCAT1:C16.1 ETHERCAT1:C17.1 | 11.16,21.64 9.23,19.7 v9.23,16.39
ETHERCAT1:VDD12TX  (via drill 0.25)
  Top 0.229: ETHERCAT1:IC3.56 24.48,14.75 v24.89,15.16 | ETHERCAT1:IC3.59 23.48,16.25 23.78,16.54 23.84,16.6 v24.83,16.6
  Bottom 0.229: ETHERCAT1:C9.1 ETHERCAT1:C8.1 26.1,17.87 v24.83,16.6 | ETHERCAT1:C7.1 ETHERCAT1:C6.1 | ETHERCAT1:C7.1 26.09,15.16 v24.89,15.16 | v24.83,16.6 24.58,16.35 21.54,16.35 21.54,11.8 21.54,11.74 21,11.2 16.2,11.2 15.59,10.59 ETHERCAT1:L4.2 | v24.83,16.6 26.02,16.6 ETHERCAT1:C7.1
ETHERCAT1:VDD33BIAS  (via drill 0.25)
  Top 0.229: v24,15.75 ETHERCAT1:IC3.58
  Bottom 0.229: ETHERCAT1:L3.2 24.01,12.53 v24,15.75 24,13.95 ETHERCAT1:C5.1
ETHERCAT1:VDD33TXRX1  (via drill 0.2)
  Top 0.229: ETHERCAT1:IC3.51 v27.05,12.25 v27.06,12.26
  Bottom 0.229: ETHERCAT1:R11.2 ETHERCAT1:R10.2 28.55,12.21 ETHERCAT1:R9.2 28.48,12.26 v27.06,12.26 28.55,12.26 ETHERCAT1:R8.2 ETHERCAT1:R16.2 28.55,9.2 ETHERCAT1:C2.1 ETHERCAT1:C1.1
  Bottom 0.305: v27.06,12.26 25.73,12.26 ETHERCAT1:L1.2
ETHERCAT1:VDD33TXRX2  (via drill 0.2, 0.3)
  Top 0.229: v26.91,20.52 25.15,18.75 ETHERCAT1:IC3.64 v22.66,19.46
  Bottom 0.229: ETHERCAT1:R15.2 ETHERCAT1:R14.2 ETHERCAT1:R13.2 29.04,23.54 ETHERCAT1:R12.2 ETHERCAT1:R17.2 | v26.91,20.52 29.04,20.52 ETHERCAT1:R15.2 | v22.66,19.46 22.66,23.49 ETHERCAT1:L2.2 | ETHERCAT1:R15.2 29.04,19.36 ETHERCAT1:C4.1 ETHERCAT1:C3.1
GND  (via drill 0.2, 0.3, 0.35)
  Top 0.152: ETHERCAT1:IC3.41 17.25,5.2 17.04,4.99 ETHERCAT1:C19.2
  Top 0.229: v16.66,23.76 16.53,23.62 16.26,23.62 16.26,21.21 | ETHERCAT1:IC3.4 19.25,22.25 v19.5,22.5
  Bottom 0.229: ETHERCAT1:IC1.7 19.04,5.19 ETHERCAT1:IC1.9
  other vias: 16.57,27.67 19.04,13.14 19.04,15.14 19.04,17.14 18.04,14.14 18.04,16.14 17.04,17.14 16.04,14.14 16.04,16.14 15.04,13.14 15.04,15.14 15.04,17.14 23.04,3.14 26.54,1.99 9.44,3.99 8.44,4.39 15.91,3.39 16.79,3.39 18.54,27.89 39.54,20.89 14.57,28.17
  pour Top (isolate 0.305): 0,30 70,30 70,0 0,0
  pour Bottom (isolate 0.305): 0,30 70,30 70,0 0,0
RA_N
  Top 0.254: 58.1,17.53 XIN.3
  Top 0.406: ETHERCAT1:X1.4 52.04,11.46 58.1,17.53
  Top 0.61: ETHERCAT1:T1.9 33.84,6.07 38.01,10.23 43.26,10.23 44.49,11.46 ETHERCAT1:X1.4
RA_P
  Top 0.406: ETHERCAT1:X1.3 52.47,9.96 53,10.5 53,11.5 55.97,14.47 XIN.6
  Top 0.61: ETHERCAT1:T1.10 35.12,5.96 38.37,9.21 43.79,9.21 44.54,9.96 ETHERCAT1:X1.3
SYNC0  (via drill 0.2)
  Top 0.229: ETHERCAT1:IC3.34 13.75,8.15 13.4,7.8 10.8,7.8 v10.6,7.6
  Bottom 0.229: v10.6,7.6 9.2,9 8,9 7,10 2.2,10 1.4,10.8 1.4,17.48 SV1.8
SYNC1
  Top 0.203: ETHERCAT1:IC3.18 10.35,18.25 9.2,19.4 5.86,19.4 SV1.7
TA_N  (via drill 0.35)
  Top 0.406: ETHERCAT1:X1.2 52.97,8.46 v53,8.5
  Top 0.61: ETHERCAT1:T1.15 41.47,6.57 43.29,8.39 48.79,8.39 48.72,8.46 ETHERCAT1:X1.2
  Bottom 0.406: v53,8.5 53,15 58,20 61.03,20 XIN.1
TA_P  (via drill 0.35)
  Top 0.406: ETHERCAT1:X1.1 52.97,6.96 v53,7
  Top 0.61: ETHERCAT1:T1.16 42.73,6.57 43.13,6.96 ETHERCAT1:X1.1
  Bottom 0.406: v53,7 55,7 57,9 57,17.87 57.68,18.55 XIN.2

### Text on the board
tPlace: Xplained Pro - Ethercat Extention | MSRM